# EAGLE design LabPowerSupply_CurrentModuleV1.1 (EAGLE 6.3)
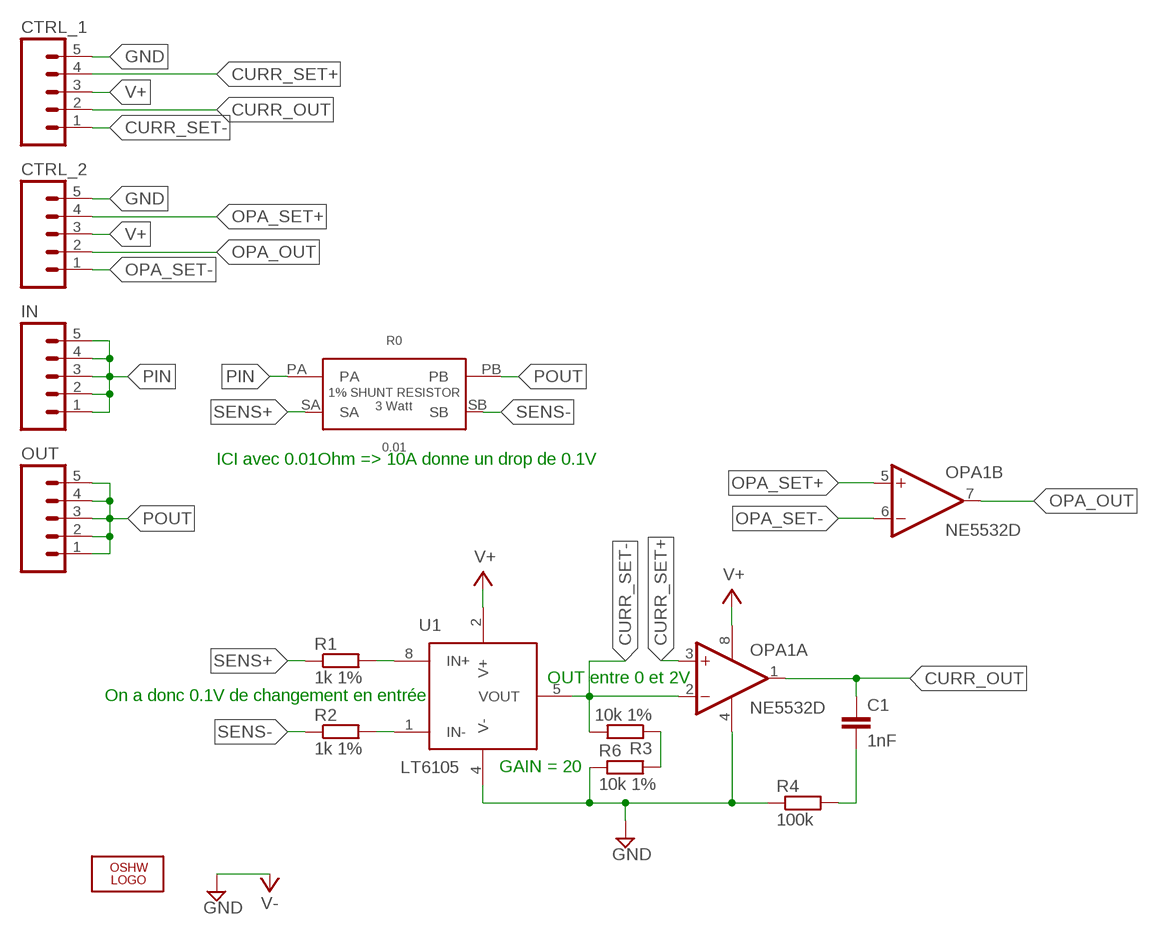
[diagram p0: schematic, sheet 1]

## Parts
C1  1nF  C-EUC1206K  [C1206K]
CTRL_1  M05PTH_LONGPADS  [1X05_LONGPADS]
CTRL_2  M05PTH_LONGPADS  [1X05_LONGPADS]
IN  M05PTH_LONGPADS  [1X05_LONGPADS]
LOGO1  OSHW_LOGO_FILLX0150-NT  [OSHW_FILLX150_NOTEXT]
OPA1  NE5532D  [SO08]
OUT  M05PTH_LONGPADS  [1X05_LONGPADS]
R0  0.01  WSL3637R0100FEA  [3637R]
R1  1k 1%  R-EU_R1206  [R1206]
R2  1k 1%  R-EU_R1206  [R1206]
R3  10k 1%  R-EU_R1206  [R1206]
R4  100k  R-EU_R1206  [R1206]
R6  10k 1%  R-EU_R1206  [R1206]
U1  LT6105  [MSOP_8]

## Nets
CURR_OUT: C1.1 CTRL_1.2 OPA1.1(A:OUT)
CURR_SET+: CTRL_1.4 OPA1.3(A:+IN)
CURR_SET-: CTRL_1.1 OPA1.2(A:-IN) R3.2 U1.5(VOUT)
GND: CTRL_1.5 CTRL_2.5 OPA1.4(P:V-) R4.1 R6.1 U1.4(V-) ; supply symbol labelled V-
N$2: R1.2 U1.8(IN+)
N$3: R2.2 U1.1(IN-)
N$5: C1.2 R4.2
N$7: R3.1 R6.2
OPA_OUT: CTRL_2.2 OPA1.7(B:OUT)
OPA_SET+: CTRL_2.4 OPA1.5(B:+IN)
OPA_SET-: CTRL_2.1 OPA1.6(B:-IN)
PIN: IN.1 IN.2 IN.3 IN.4 IN.5 R0.PA
POUT: OUT.1 OUT.2 OUT.3 OUT.4 OUT.5 R0.PB
SENS+: R0.SA R1.1
SENS-: R0.SB R2.1
V+: CTRL_1.3 CTRL_2.3 OPA1.8(P:V+) U1.2(V+)

## Notes on the sheet
- ICI avec 0.01Ohm => 10A donne un drop de 0.1V
- OUT entre 0 et 2V
- On a donc 0.1V de changement en entrée
- GAIN = 20

## Library data of the parts
C1 = rcl:C-EU: CAPACITOR, European symbol
CTRL_1 CTRL_2 IN OUT = SparkFun-Connectors:M05: Header 5 Standard 5-pin 0.1" header. Use with straight break away headers (SKU : PRT-00116), right angle break away headers (PRT-00553), swiss pins (PRT-00743), machine pins (PRT-00117), and female headers (PRT-00115). Molex polarized connector foot print use with SKU : PRT-08230 with associated crimp pins and housings.
LOGO1 = ohw-logo:OSHW_LOGO_FILL
OPA1 = linear:NE5532: AUDIO AMPLIFIER
R0 = LabPowerSupplyComponents:WSL3637R0100FEA
R1-R4 R6 = rcl:R-EU_: RESISTOR, European symbol
U1 = components:LT6105

## Board
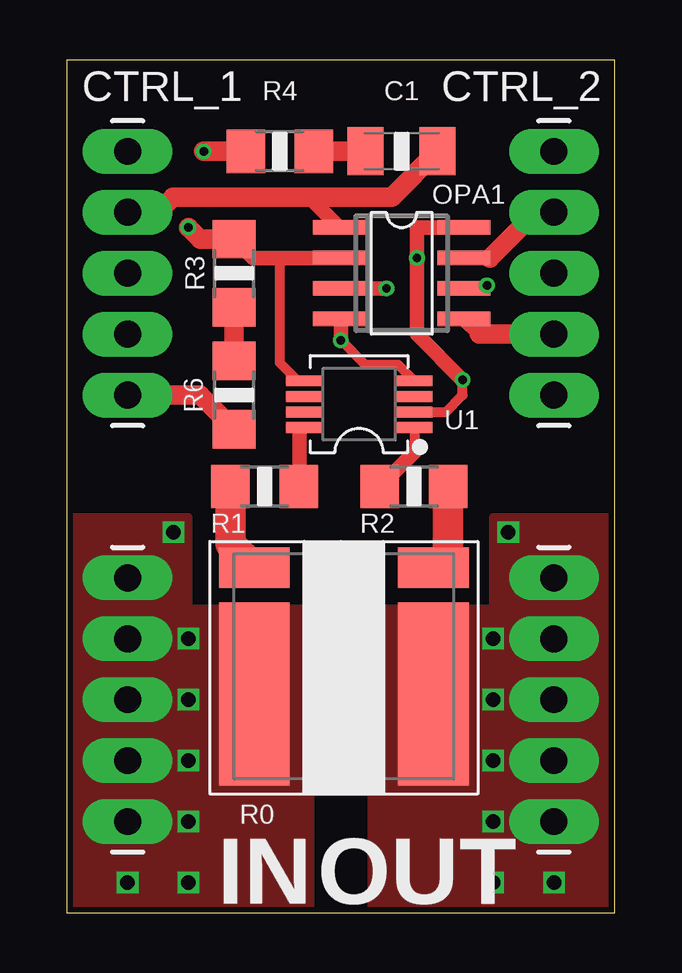
[diagram p1: board, top side]
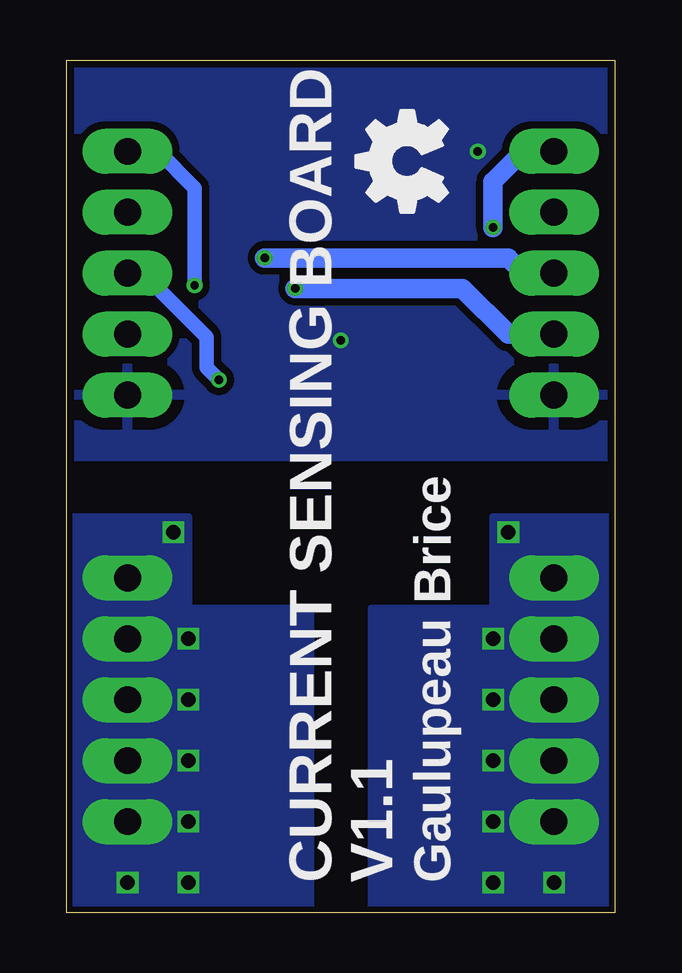
[diagram p2: board, bottom side, seen from below]

Size 22.86 x 35.56 mm. Coordinates in mm from the lower left corner, seen from the top.
Outline: 0,0 22.86,0 22.86,35.56 0,35.56 0,0
Copper layers (1*16): Top 0.035mm / dielectric 1.5mm / Bottom 0.035mm
Design rules "ITEADstudio_DRC_restrict": minimum track width 6mil, minimum drill 12mil, track to track 6mil, track to pad 6mil, pad to pad 6mil, via to via 6mil, smd to smd 0mil, copper to edge 10mil, drill to drill 10mil, minimum pad ring 10mil, minimum via ring 6mil, stop-mask expansion 2mil, vias tented up to drill 100mil, thermal gap 20mil

### Footprints (pad centres in the part's own frame; a part is rotated, then mirrored left to right if it is on the bottom)
C1206K = smd 1.5 x 2: 1 -1.5,0; 2 1.5,0
1X05_LONGPADS = drill 1.118 pad 1.88 long: 1 0,0; 2 2.54,0; 3 5.08,0; 4 7.62,0; 5 10.16,0
SO08 = smd 0.6 x 2.2: 1 -1.905,-2.6; 2 -0.635,-2.6; 3 0.635,-2.6; 4 1.905,-2.6; 5 1.905,2.6; 6 0.635,2.6; 7 -0.635,2.6; 8 -1.905,2.6
3637R = smd 2.95 x 7.62: PA -3.605,-1.02; PB 3.865,-1.02 | smd 2.95 x 1.68: SA -3.605,4.24; SB 3.865,4.24
R1206 = smd 1.6 x 1.803: 1 -1.422,0; 2 1.422,0
MSOP_8 = smd 1.5 x 0.45: 1 -2.3,0.975; 2 -2.3,0.325; 3 -2.3,-0.325; 4 -2.3,-0.975; 5 2.3,-0.975; 6 2.3,-0.325; 7 2.3,0.325; 8 2.3,0.975

### Placement (x,y rotation side)
C1  13.97,31.75 180 top
CTRL_1  2.54,31.75 270 top
CTRL_2  20.32,31.75 270 top
IN  2.54,3.81 90 top
LOGO1  6.99,29.21 90 bottom
OPA1  13.97,26.67 270 top
OUT  20.32,3.81 90 top
R0  11.43,10.16 0 top
R1  8.26,17.78 0 top
R2  14.48,17.78 180 top
R3  6.99,26.67 90 top
R4  8.89,31.75 0 top
R6  6.99,21.59 90 top
U1  12.19,21.21 180 top

### Tracks (layer width: path | path; a pad name or v marks a point on that pad's centre or on a via)
CURR_OUT
  Top 0.61: OPA1.1 10.1,29.84
  Top 0.813: CTRL_1.2 3.81,29.21 4.45,29.84 10.1,29.84 13.56,29.84 C1.1
CURR_SET+  (via drill 0.35)
  Top 0.61: OPA1.3 v13.34,26.04
  Bottom 0.813: v13.34,26.04 6.35,26.04 4.45,24.13 CTRL_1.4
CURR_SET-  (via drill 0.35)
  Top 0.406: 8.89,27.3 8.89,22.93 9.64,22.18 U1.5
  Top 0.61: OPA1.2 8.89,27.3 7.77,27.3 R3.2
  Top 0.813: R3.2 5.56,28.09 v5.08,28.57
  Bottom 0.813: v5.08,28.57 5.08,30.48 3.81,31.75 CTRL_1.1
GND  (via drill 0.35)
  Top 0.406: OPA1.4 11.18,24.77 | U1.4 13.82,22.86 12.45,22.86 v11.43,23.88
  Top 0.61: OPA1.4 11.43,24.77 v11.43,23.88
  Top 0.813: R4.1 v5.71,31.75 | R6.1 5.56,21.59 CTRL_1.5
  pour Bottom (isolate 0.305): 0,35.56 22.86,35.56 22.86,19.05 0,19.05
N$2
  Top 0.406: 9.71,17.82 R1.2 9.64,17.82 | 9.71,20.06 U1.8
  Top 0.61: 9.71,17.82 9.71,20.06
N$3
  Top 0.406: U1.1 14.49,19.22
  Top 0.61: 14.49,19.22 R2.2
N$5
  Top 0.813: R4.2 C1.2
N$7
  Top 0.813: R6.2 R3.1
OPA_OUT
  Top 0.61: 17.65,27.3 OPA1.7
  Top 0.813: CTRL_2.2 19.56,29.21 17.65,27.3
OPA_SET+
  Top 0.61: OPA1.5 17.2,24.13
  Top 0.813: 17.2,24.13 CTRL_2.4
OPA_SET-  (via drill 0.35)
  Top 0.61: OPA1.6 17.4,26.04 v17.53,26.16
  Bottom 0.61: v17.53,26.16 17.53,30.23 19.05,31.75 CTRL_2.1
PIN  (via drill 0.6)
  other vias: 5.08,1.27 4.45,15.88 2.54,1.27 5.08,11.43 5.08,8.89 5.08,6.35 5.08,3.81
  pour Bottom (no thermals): 0,16.51 5.08,16.51 5.08,12.7 10.16,12.7 10.16,0 0,0
  pour Top (no thermals): 0,16.51 5.08,16.51 5.08,12.7 10.16,12.7 10.16,0 0,0
POUT  (via drill 0.6)
  other vias: 20.32,1.27 18.41,15.88 17.78,1.27 17.78,11.43 17.78,8.89 17.78,6.35 17.78,3.81
  pour Bottom (no thermals): 12.7,12.7 17.78,12.7 17.78,16.51 22.86,16.51 22.86,0 12.7,0
  pour Top (no thermals): 12.7,12.7 17.78,12.7 17.78,16.51 22.86,16.51 22.86,0 12.7,0
SENS+
  Top 1.27: R0.SA 6.83,15.39 R1.1
SENS-
  Top 1.27: R2.1 15.9,15.01 R0.SB
V+  (via drill 0.35)
  Top 0.406: U1.2 15.8,20.88 16.51,21.59 v16.51,22.23
  Top 0.61: OPA1.8 14.61,28.57 v14.61,27.3 14.61,24.13 v16.51,22.23
  Bottom 0.61: CTRL_2.3 19.68,26.67 17.02,24 17.02,22.73 v16.51,22.23
  Bottom 0.813: CTRL_1.3 3.81,26.67 4.45,27.3 v14.61,27.3

### Text on the board
bNames: Gaulupeau Brice | V1.1 | CURRENT SENSING BOARD